# EAGLE schematic UV_Arduino_PC_board (EAGLE 7.1.0)
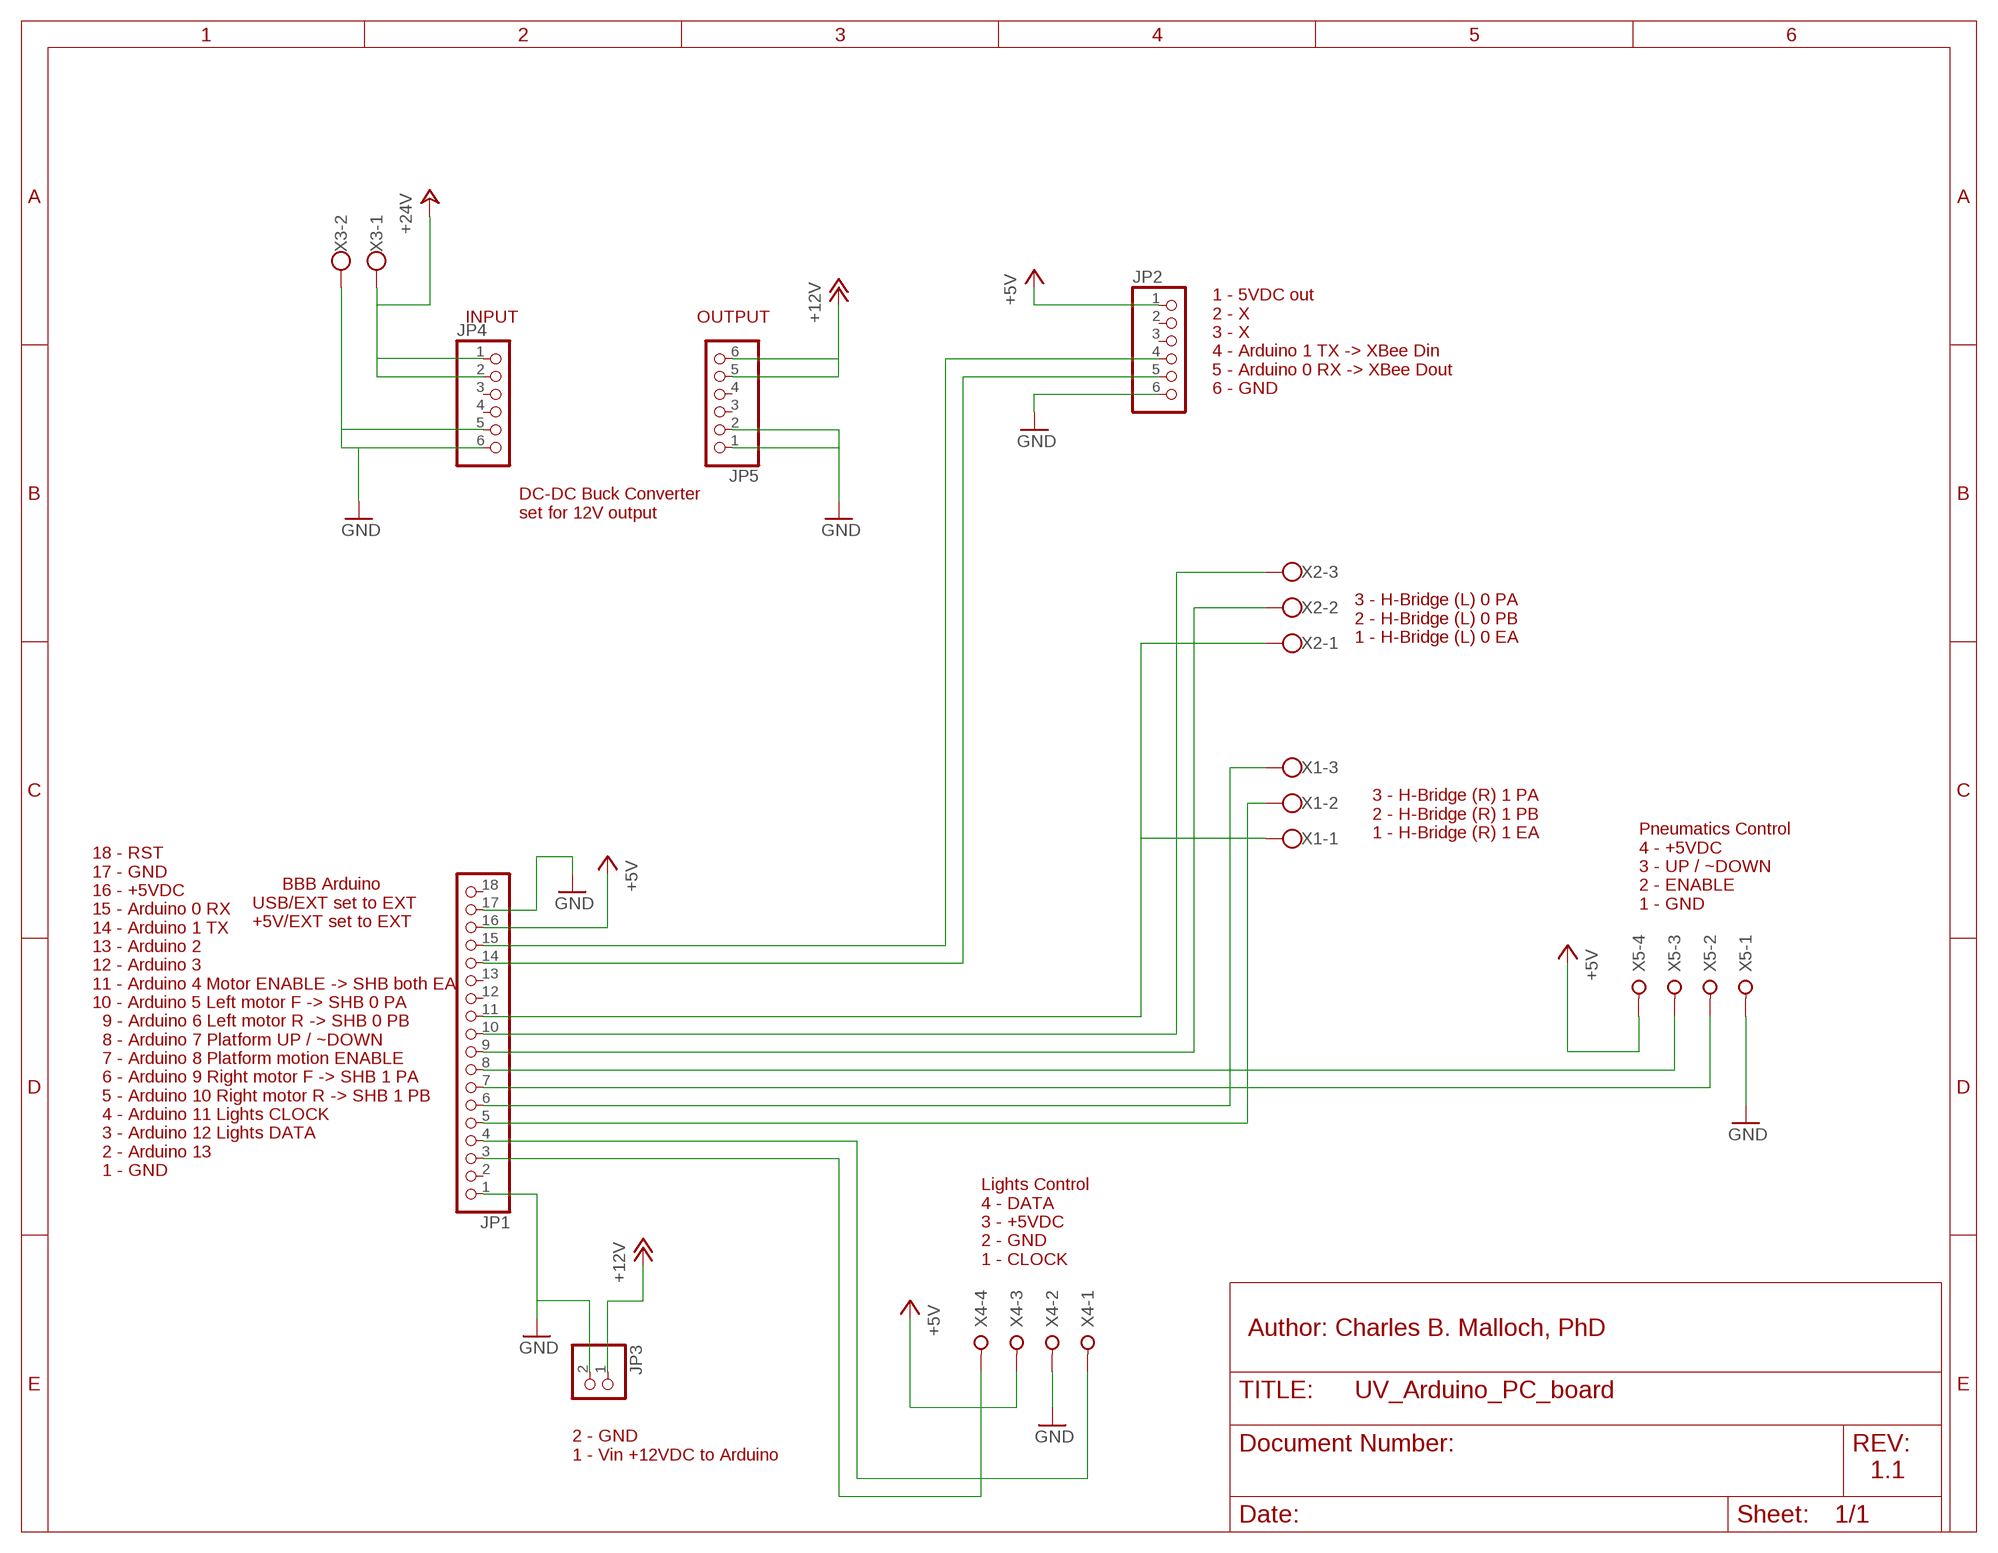
[diagram p0: schematic, sheet 1]

## Parts
JP1  PINHD-1X18  [1X18]
JP2  PINHD-1X6  [1X06]
JP3  PINHD-1X2  [1X02]
JP4  PINHD-1X6  [1X06]
JP5  PINHD-1X6  [1X06]
X1  W237-103  [W237-103]
X2  W237-103  [W237-103]
X3  W237-102  [W237-102]
X4  W237-04P  [W237-4P]
X5  W237-04P  [W237-4P]

## Nets
+5V: JP1.16 JP2.1 X4.3 X5.4
+12V: JP3.1 JP5.5 JP5.6
GND: JP1.1 JP1.17 JP2.6 JP3.2 JP4.5 JP4.6 JP5.1 JP5.2 X3.2 X4.2 X5.1
N$1: JP4.1 JP4.2 X3.1
N$2: JP1.14 JP2.5
N$3: JP1.4 X4.1
N$4: JP1.3 X4.4
N$5: JP1.11 X1.1 X2.1
N$6: JP1.10 X2.3
N$7: JP1.9 X2.2
N$8: JP1.6 X1.3
N$9: JP1.5 X1.2
N$10: JP1.15 JP2.4
N$12: JP1.8 X5.3
N$13: JP1.7 X5.2
Unconnected: JP1.2 JP1.12 JP1.13 JP1.18 JP2.2 JP2.3 JP4.3 JP4.4 JP5.3 JP5.4

## Notes on the sheet
- INPUT | OUTPUT
- 1 - 5VDC out
  2 - X
  3 - X
  4 - Arduino 1 TX -> XBee Din
  5 - Arduino 0 RX -> XBee Dout
  6 - GND
- DC-DC Buck Converter
  set for 12V output
- 3 - H-Bridge (L) 0 PA
  2 - H-Bridge (L) 0 PB
  1 - H-Bridge (L) 0 EA
- 3 - H-Bridge (R) 1 PA
  2 - H-Bridge (R) 1 PB
  1 - H-Bridge (R) 1 EA
- Pneumatics Control
  4 - +5VDC
  3 - UP / ~DOWN
  2 - ENABLE
  1 - GND
- BBB Arduino
  USB/EXT set to EXT
  +5V/EXT set to EXT
- 18 - RST
  17 - GND
  16 - +5VDC
  15 - Arduino 0 RX
  14 - Arduino 1 TX
  13 - Arduino 2
  12 - Arduino 3
  11 - Arduino 4 Motor ENABLE -> SHB both EA
  10 - Arduino 5 Left motor F -> SHB 0 PA
    9 - Arduino 6 Left motor R -> SHB 0 PB
    8 - Arduino 7 Platform UP / ~DOWN
    7 - Arduino 8 Platform motion ENABLE
    6 - Arduino 9 Right motor F -> SHB 1 PA
    5 - Arduino 10 Right motor R -> SHB 1 PB
    4 - Arduino 11 Lights CLOCK
    3 - Arduino 12 Lights DATA
    2 - Arduino 13
    1 - GND
- Lights Control
  4 - DATA
  3 - +5VDC
  2 - GND
  1 - CLOCK
- Author: Charles B. Malloch, PhD
- 2 - GND
  1 - Vin +12VDC to Arduino
- 1.1

## Library data of the parts
JP1 = pinhead:PINHD-1X18: PIN HEADER
JP2 JP4 JP5 = pinhead:PINHD-1X6: PIN HEADER
JP3 = pinhead:PINHD-1X2: PIN HEADER
X1 X2 = con-wago-500:W237-103: WAGO SCREW CLAMP; MPN: 237-103; OC_FARNELL: unknown; OC_NEWARK: 18M7116
X3 = con-wago-500:W237-102: WAGO SCREW CLAMP; MPN: 237-102; OC_FARNELL: unknown; OC_NEWARK: 70K9898
X4 X5 = con-wago-508:W237-04P: WAGO SREW CLAMP; OC_FARNELL: unknown; OC_NEWARK: unknown